# EAGLE design power_tester (EAGLE 6.1)
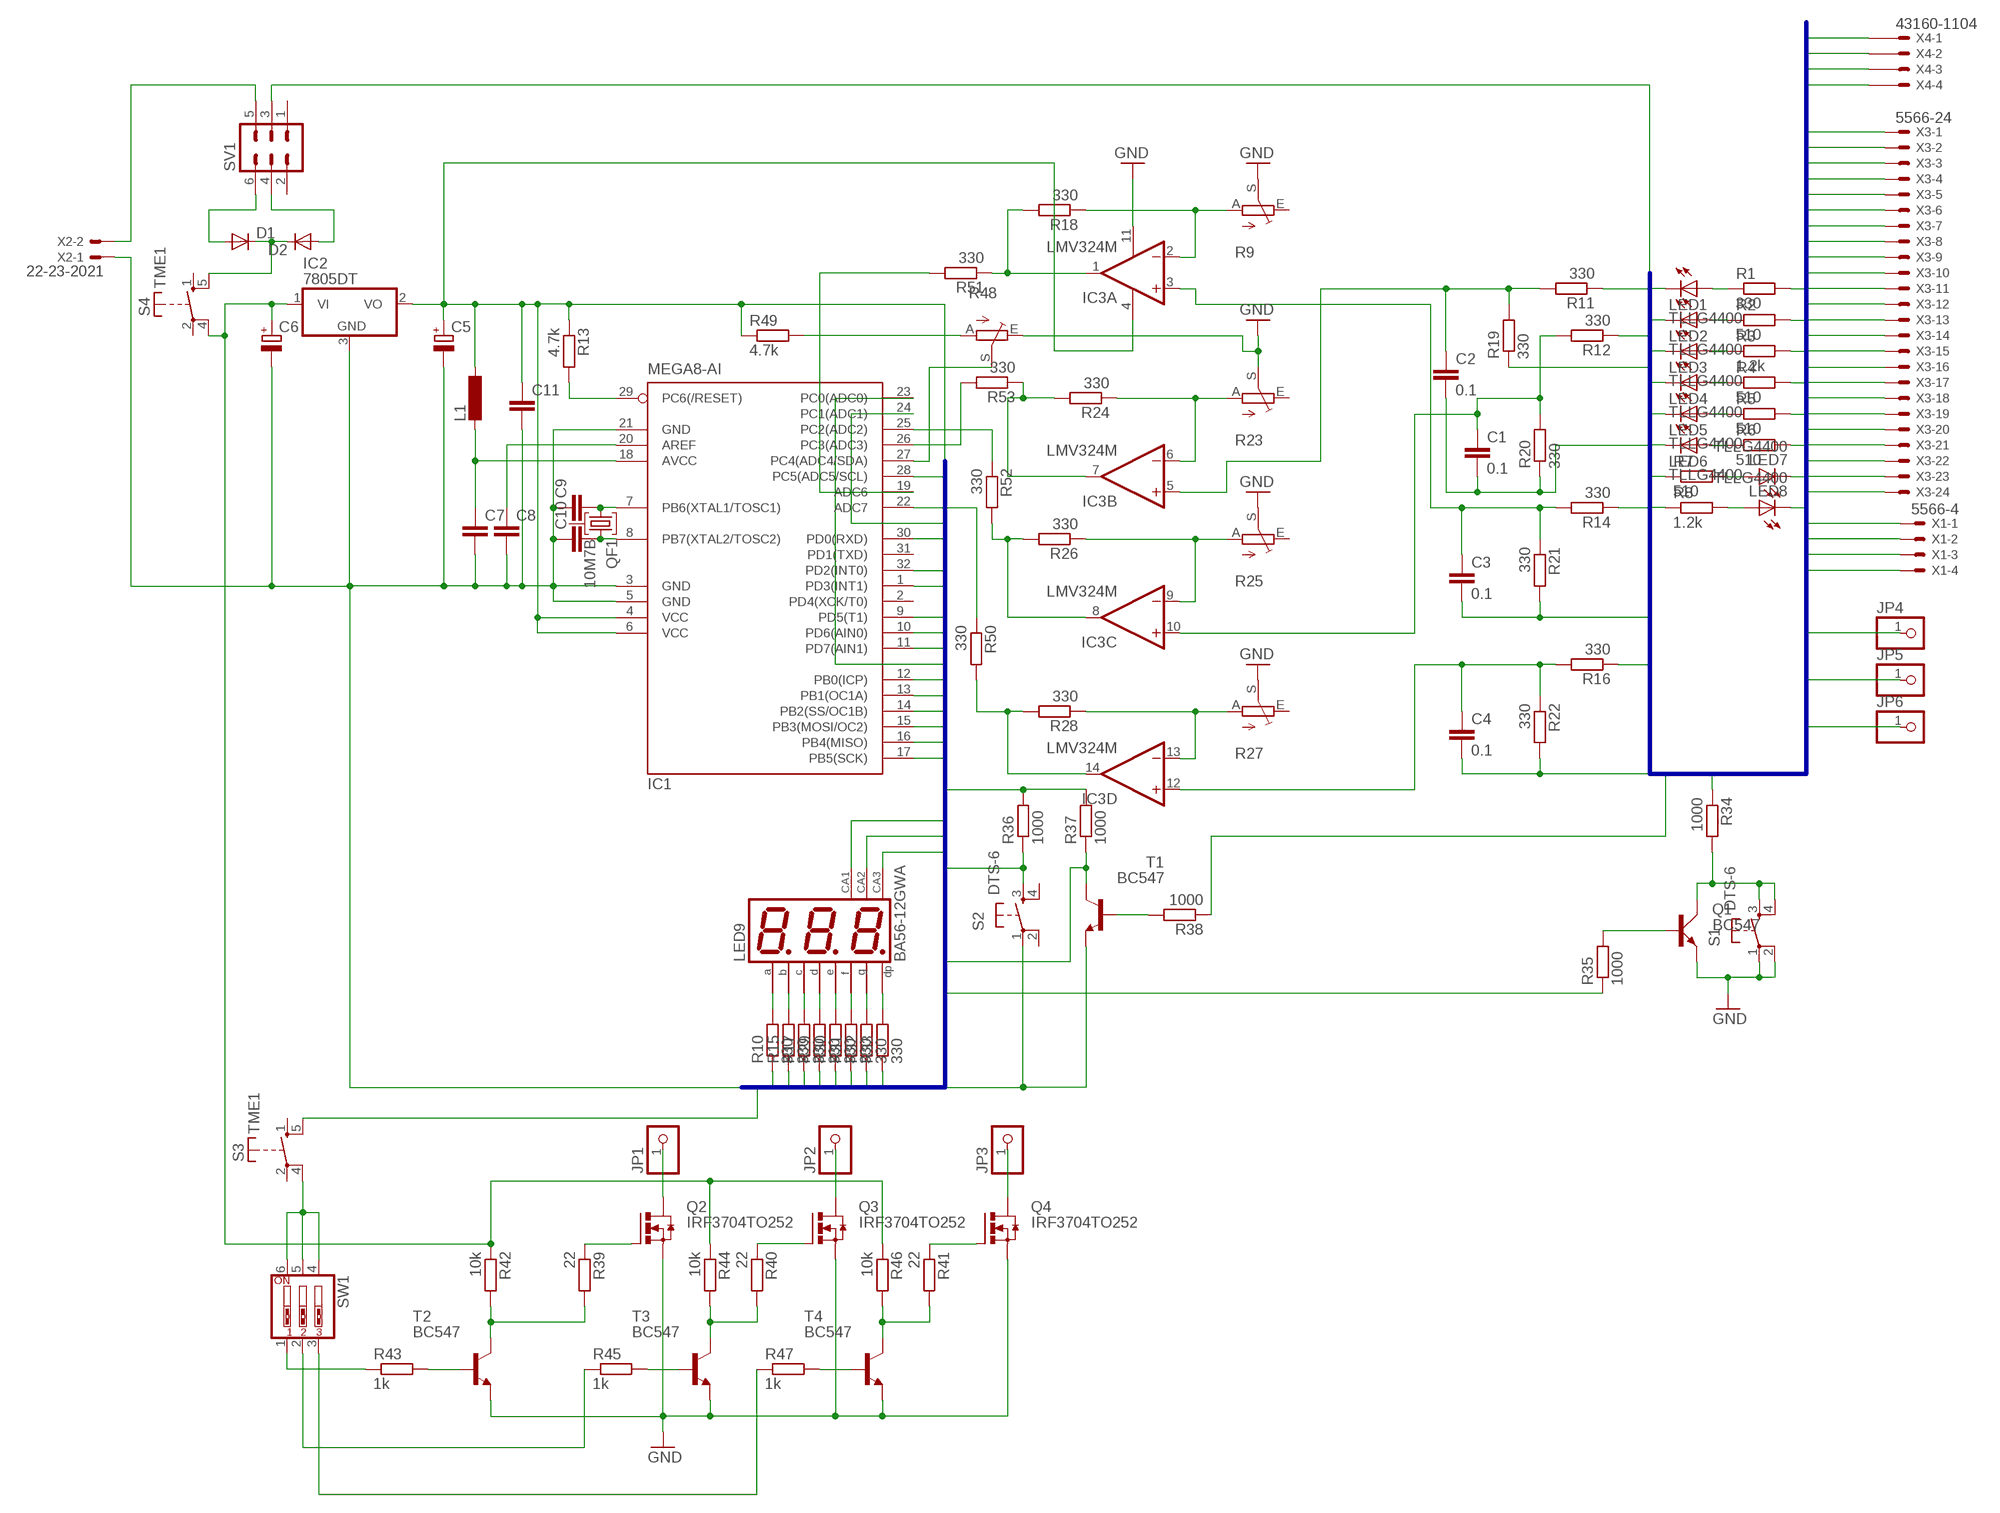
[diagram p0: schematic, sheet 1]

## Parts
C1  0.1  C-EUC1206  [C1206]
C2  0.1  C-EUC1206  [C1206]
C3  0.1  C-EUC1206  [C1206]
C4  0.1  C-EUC1206  [C1206]
C5  CPOL-EUE2.5-7  [E2,5-7]
C6  CPOL-EUE2.5-7  [E2,5-7]
C7  C-EUC1206  [C1206]
C8  C-EUC0805K  [C0805K]
C9  C-EUC1206  [C1206]
C10  C-EUC1206  [C1206]
C11  C-EUC1206  [C1206]
D1  DIODE-DO214BA  [DO214BA]
D2  DIODE-DO214BA  [DO214BA]
IC1  MEGA8-AI  [TQFP32-08]
IC2  7805DT  [TO252]
IC3  LMV324M  [SO14]
JP1  PINHD-1X1  [1X01]
JP2  PINHD-1X1  [1X01]
JP3  PINHD-1X1  [1X01]
JP4  PINHD-1X1  [1X01]
JP5  PINHD-1X1  [1X01]
JP6  PINHD-1X1  [1X01]
L1  DO3316P  [DO3316P]
LED1  TLLG4400  [LED3MM]
LED2  TLLG4400  [LED3MM]
LED3  TLLG4400  [LED3MM]
LED4  TLLG4400  [LED3MM]
LED5  TLLG4400  [LED3MM]
LED6  TLLG4400  [LED3MM]
LED7  TLLG4400  [LED3MM]
LED8  TLLG4400  [LED3MM]
LED9  BA56-12GWA  [BX56-12]
Q1  BC547  [SOT54A]
Q2  IRF3704TO252  [D-PAK_TO252AA]
Q3  IRF3704TO252  [D-PAK_TO252AA]
Q4  IRF3704TO252  [D-PAK_TO252AA]
QF1  10M7B  [HC49U]
R1  330  R-EU_R1206  [R1206]
R2  510  R-EU_R1206  [R1206]
R3  1.2k  R-EU_R1206  [R1206]
R4  510  R-EU_R1206  [R1206]
R5  510  R-EU_R1206  [R1206]
R6  510  R-EU_R1206  [R1206]
R7  510  R-EU_R1206  [R1206]
R8  1.2k  R-EU_R1206  [R1206]
R9  TRIM_EU-S64W  [S64W]
R10  330  R-EU_R1206W  [R1206W]
R11  330  R-EU_R1206  [R1206]
R12  330  R-EU_R1206  [R1206]
R13  4.7k  R-EU_R1206W  [R1206W]
R14  330  R-EU_R1206  [R1206]
R15  330  R-EU_R1206W  [R1206W]
R16  330  R-EU_R1206  [R1206]
R17  330  R-EU_R1206  [R1206]
R18  330  R-EU_R1206  [R1206]
R19  330  R-EU_R1206  [R1206]
R20  330  R-EU_R1206  [R1206]
R21  330  R-EU_R1206  [R1206]
R22  330  R-EU_R1206  [R1206]
R23  TRIM_EU-S64W  [S64W]
R24  330  R-EU_R1206  [R1206]
R25  TRIM_EU-S64W  [S64W]
R26  330  R-EU_R1206  [R1206]
R27  TRIM_EU-S64W  [S64W]
R28  330  R-EU_R1206  [R1206]
R29  330  R-EU_R1206  [R1206]
R30  330  R-EU_R1206  [R1206]
R31  330  R-EU_R1206W  [R1206W]
R32  330  R-EU_R1206W  [R1206W]
R33  330  R-EU_R1206W  [R1206W]
R34  1000  R-EU_R1206  [R1206]
R35  1000  R-EU_R1206W  [R1206W]
R36  1000  R-EU_R1206W  [R1206W]
R37  1000  R-EU_R1206W  [R1206W]
R38  1000  R-EU_R1206  [R1206]
R39  22  R-EU_R1206W  [R1206W]
R40  22  R-EU_R1206W  [R1206W]
R41  22  R-EU_R1206W  [R1206W]
R42  10k  R-EU_R1206W  [R1206W]
R43  1k  R-EU_R1206  [R1206]
R44  10k  R-EU_R1206W  [R1206W]
R45  1k  R-EU_R1206  [R1206]
R46  10k  R-EU_R1206W  [R1206W]
R47  1k  R-EU_R1206  [R1206]
R48  TRIM_EU-CA6V  [CA6V]
R49  4.7k  R-EU_R1206  [R1206]
R50  330  R-EU_R1206  [R1206]
R51  330  R-EU_R1206W  [R1206W]
R52  330  R-EU_R1206  [R1206]
R53  330  R-EU_R1206  [R1206]
S1  DTS-6  [DTS-6]
S2  DTS-6  [DTS-6]
S3  TME1  [TME1]
S4  TME1  [TME1]
SV1  MA03-2  [MA03-2]
SW1  SW_DIP-3  [EDG-03]
T1  BC547  [TO92]
T2  BC547  [TO92]
T3  BC547  [TO92]
T4  BC547  [TO92]
X1  5566-4  [5566-4]
X2  22-23-2021  [22-23-2021]
X3  5566-24  [5566-24]
X4  43160-1104  [43160-XX04]

## Nets
A: IC1.17(PB5(SCK)) R10.1
B: IC1.16(PB4(MISO)) R15.1
C: IC1.15(PB3(MOSI/OC2)) R17.1
CA1: IC1.23(PC0(ADC0)) LED9.12(CA)
CA2: IC1.24(PC1(ADC1)) LED9.9(CA)
CA3: IC1.28(PC5(ADC5/SCL)) LED9.8(CA)
D: IC1.14(PB2(SS/OC1B)) R29.1
DEGUR_5V: R6.2 R16.1 X3.9
DOWN_TO_ZERO: Q1.C R34.2 S1.3 S1.4
DP: IC1.9(PD5(T1)) R33.1
E: IC1.12(PB0(ICP)) R30.1
F: IC1.11(PD7(AIN1)) R31.1
G: IC1.10(PD6(AIN0)) R32.1
GND: C1.2 C2.2 C3.2 C4.2 C5.- C6.- C7.2 C8.2 C9.1 C10.1 C11.2 IC1.3(GND) IC1.5(GND) IC1.21(GND) IC2.3(GND) IC3.11(P:V-) LED1.K(C) LED2.K(C) LED3.K(C) LED4.K(C) LED5.K(C) LED6.K(C) Q1.E Q2.4(S) Q3.4(S) Q4.4(S) R7.1 R8.1 R9.S R19.1 R20.1 R21.2 R22.2 R23.S R25.S R27.S R48.E S1.1 S1.2 S2.1 T1.1(E) T2.1(E) T3.1(E) T4.1(E) X1.1 X1.2 X2.1 X3.3 X3.5 X3.7 X3.15 X3.17 X3.18 X3.19 X3.24 X4.2@1(-2:S) X4.3@1(-3:S)
LED_SWITCH: IC1.1(PD3(INT1)) R36.1 S2.3
N$1: LED1.A R1.1
N$2: LED3.A R3.1
N$3: LED2.A R2.1
N$4: LED4.A R4.1
N$5: LED5.A R5.1
N$6: LED6.A R6.1
N$7: LED7.A R7.2
N$8: LED8.A R8.2
N$9: IC1.29(PC6(/RESET)) R13.2
N$10: R39.2 R42.2 T2.3(C)
N$11: R40.2 R44.2 T3.3(C)
N$12: C3.1 IC3.3(A:+IN) R14.2 R21.1
N$13: IC3.2(A:-IN) R9.A R18.1
N$14: C4.1 IC3.12(D:+IN) R16.2 R22.1
N$15: C2.1 IC3.5(B:+IN) R11.2 R19.2
N$16: C1.1 IC3.10(C:+IN) R12.2 R20.2
N$17: C9.2 IC1.7(PB6(XTAL1/TOSC1)) QF1.1
N$18: C10.2 IC1.8(PB7(XTAL2/TOSC2)) QF1.3
N$19: C6.+ IC2.1(VI) R42.1 R44.1 R46.1 S4.4(P)
N$20: IC3.1(A:OUT) R18.2 R51.1
N$21: IC3.7(B:OUT) R24.2 R53.1
N$22: IC3.6(B:-IN) R23.A R24.1
N$23: D1.A SV1.6
N$24: IC3.8(C:OUT) R26.2 R52.2
N$25: IC3.9(C:-IN) R25.A R26.1
N$26: IC3.14(D:OUT) R28.2 R50.2
N$27: IC3.13(D:-IN) R27.A R28.1
N$28: LED9.11(A) R10.2
N$29: D2.A SV1.4
N$30: LED9.7(B) R15.2
N$31: SV1.5 X2.2
N$32: LED9.4(C) R17.2
N$33: C7.1 IC1.18(AVCC) L1.1
N$34: LED9.2(D) R29.2
N$35: LED9.1(E) R30.2
N$36: LED9.10(F) R31.2
N$37: LED9.5(G) R32.2
N$38: LED9.3(DP) R33.2
N$39: Q1.B R35.2
N$40: R38.2 T1.2(B)
N$41: R47.2 T4.2(B)
N$42: Q3.1(G) R40.1
N$43: Q4.1(G) R41.1
N$44: Q2.1(G) R39.1
N$45: R41.2 R46.2 T4.3(C)
N$46: R43.2 T2.2(B)
N$47: JP1.1 Q2.3(D)
N$48: JP2.1 Q3.3(D)
N$49: JP3.1 Q4.3(D)
N$50: R45.2 T3.2(B)
N$51: R48.A R49.2
N$52: R43.1 SW1.1
N$53: R45.1 SW1.2
N$54: R47.1 SW1.3
N$55: S3.4(P) SW1.4 SW1.5 SW1.6
N$56: IC1.27(PC4(ADC4/SDA)) R48.S
N$57: D1.C D2.C S4.5(S)
N$58: IC1.22(ADC7) R50.1
N$59: IC1.19(ADC6) R51.2
N$60: IC1.25(PC2(ADC2)) R52.1
N$61: IC1.26(PC3(ADC3)) R53.2
N$62: C8.1 IC1.20(AREF)
PS_ON: R5.2 R34.1 X3.16
PS_ON_CONTROL: IC1.30(PD0(RXD)) R35.1
PWN_LOAD: IC1.13(PB1(OC1A)) S3.5(S)
PWR_OK: R4.2 R38.1 X3.8
PWR_OK_CONTROL: IC1.32(PD2(INT0)) R37.1 T1.3(C)
VCC5V: C5.+ C11.1 IC1.4(VCC) IC1.6(VCC) IC2.2(VO) IC3.4(P:V+) L1.2 R13.1 R36.2 R37.2 R49.1
VDC3: JP4.1 R1.2 R14.1 X3.1 X3.2 X3.12 X3.13
VDC5: JP5.1 R2.2 R11.1 X3.4 X3.6 X3.21 X3.22 X3.23 X4.4@1(-4:S)
VDC12: JP6.1 R3.2 R12.1 SV1.3 X1.3 X1.4 X3.10 X3.11 X4.1@1(-1:S)
VDC-5: LED7.K(C) X3.20
VDC-12: LED8.K(C) X3.14
Unconnected: IC1.2(PD4(XCK/T0)) IC1.31(PD1(TXD)) QF1.2 R9.E R23.E R25.E R27.E S2.2 S2.4 S3.1(S) S3.2(P) S4.1(S) S4.2(P) SV1.1 SV1.2 X4.1@2(-1:S) X4.2@2(-2:S) X4.3@2(-3:S) X4.4@2(-4:S)

## Buses
GND,VDC3,VDC5,VDC12,PWR_OK,VDC-5,VDC-12,PS_ON,DEGUR_5V
A,B,C,D,E,F,G,DP,CA[1..3],VCC5V,GND,PS_ON_CONTROL,LED_SWITCH,PWR_OK_CONTROL,PWN_LOAD

## Library data of the parts
C1-C4 C7 C8 = rcl:C-EU: CAPACITOR, European symbol
C5 C6 = rcl:CPOL-EU: POLARIZED CAPACITOR, European symbol
C9-C11 = resistor:C-EU: CAPACITOR, European symbol
D1 D2 = diode:DIODE-: DIODE
IC1 = atmel:MEGA8: MICROCONTROLLER 8 Kbytes FLASH, 1 kbytes SRAM, 512 bytes EEPROM, USART, 6-channel 10 bit ADC, 2-channel 8 bit ADC Pin compatible with Atmega48, ATMega88, ATMega168 Source: avr.lbr; MPN: ATMEGA8-16AU; OC_FARNELL: 9171371; OC_NEWARK: 73M8863
IC2 = linear:78*: Positive VOLTAGE REGULATOR Source: http://cache.national.com/ds/LM/LM78L05.pdf http://www.fairchildsemi.com/ds/LM/LM7805.pdf
IC3 = linear:LMV324?*: Quad General Purpose, Low Voltage, Rail-to-Rail Output Operational Amplifiers Source: http://www.national.com/mpf/LM/LMV321.html http://www.national.com/dt/lmv_qual.pdf
JP1-JP6 = pinhead:PINHD-1X1: PIN HEADER
L1 = inductor-coilcraft:DO3316P: COILCRAFT; OC_FARNELL: unknown; OC_NEWARK: unknown
LED1-LED8 = led:TLLG4400: Low Current (2mA) LED 3 mm Tinted Diffused Package color GREEN Source: Data sheet <http://www.farnell.com/datasheets/391098.pdf>; MF: VISHAY SEMICONDUCTOR; OC_FARNELL: 1612435
LED9 = display-kingbright:B?56-12*WA: 14.22mm (0.56INCH) THREE DIGIT NUMERIC DISPLAY Source: http://www.kingbright.com .. BA56-11EWA(Ver1189474895.pdf; OC_FARNELL: unknown; OC_NEWARK: unknown
Q1 = transistor-small-signal:BC547: NPN TRANSISTOR
Q2-Q4 = transistor-power:IRF3704: SMPS MOSFET HEXFET® Power MOSFET Source: http://www.irf.com/product-info/datasheets/data/irf3704.pdf
QF1 = crystal:10M*B: Monolithic Crystal Filters Source: www.vanlong.com; OC_FARNELL: unknown; OC_NEWARK: unknown
R1-R8 R10-R22 R24 R26 R28-R47 R49-R53 = resistor:R-EU_: RESISTOR, European symbol
R9 R23 R25 R27 R48 = pot:TRIM_EU-: POTENTIOMETER
S1 S2 = switch-tact:DTS-6
S3 S4 = switch-misc:TME1: SWITCH
SV1 = con-lstb:MA03-2: PIN HEADER; OC_FARNELL: unknown; OC_NEWARK: unknown
SW1 = special:SW_DIP-3: DIP SWITCH
T1-T4 = transistor:BC547: NPN TRANSISTOR
X1 = con-molex:5566-4: Mini FIT connector 4 pol Source: http://www.molex.com; OC_FARNELL: unknown; OC_NEWARK: unknown
X2 = con-molex:22-23-2021: .100" (2.54mm) Center Header - 2 Pin; MF: MOLEX; MPN: 22-23-2021; OC_FARNELL: 1462926; OC_NEWARK: 25C3832
X3 = con-molex:5566-24: Mini FIT connector 24 pol Source: http://www.molex.com; OC_FARNELL: unknown; OC_NEWARK: unknown
X4 = con-molex:43160-*04: SDA-43160 Connector Source: http://www.molex.com/pdm_docs/sd/431601306_sd.pdf; MF: WALDOM/MOLEX; MPN: 43160-1104; OC_FARNELL: unknown; OC_NEWARK: 54H0257

## Board
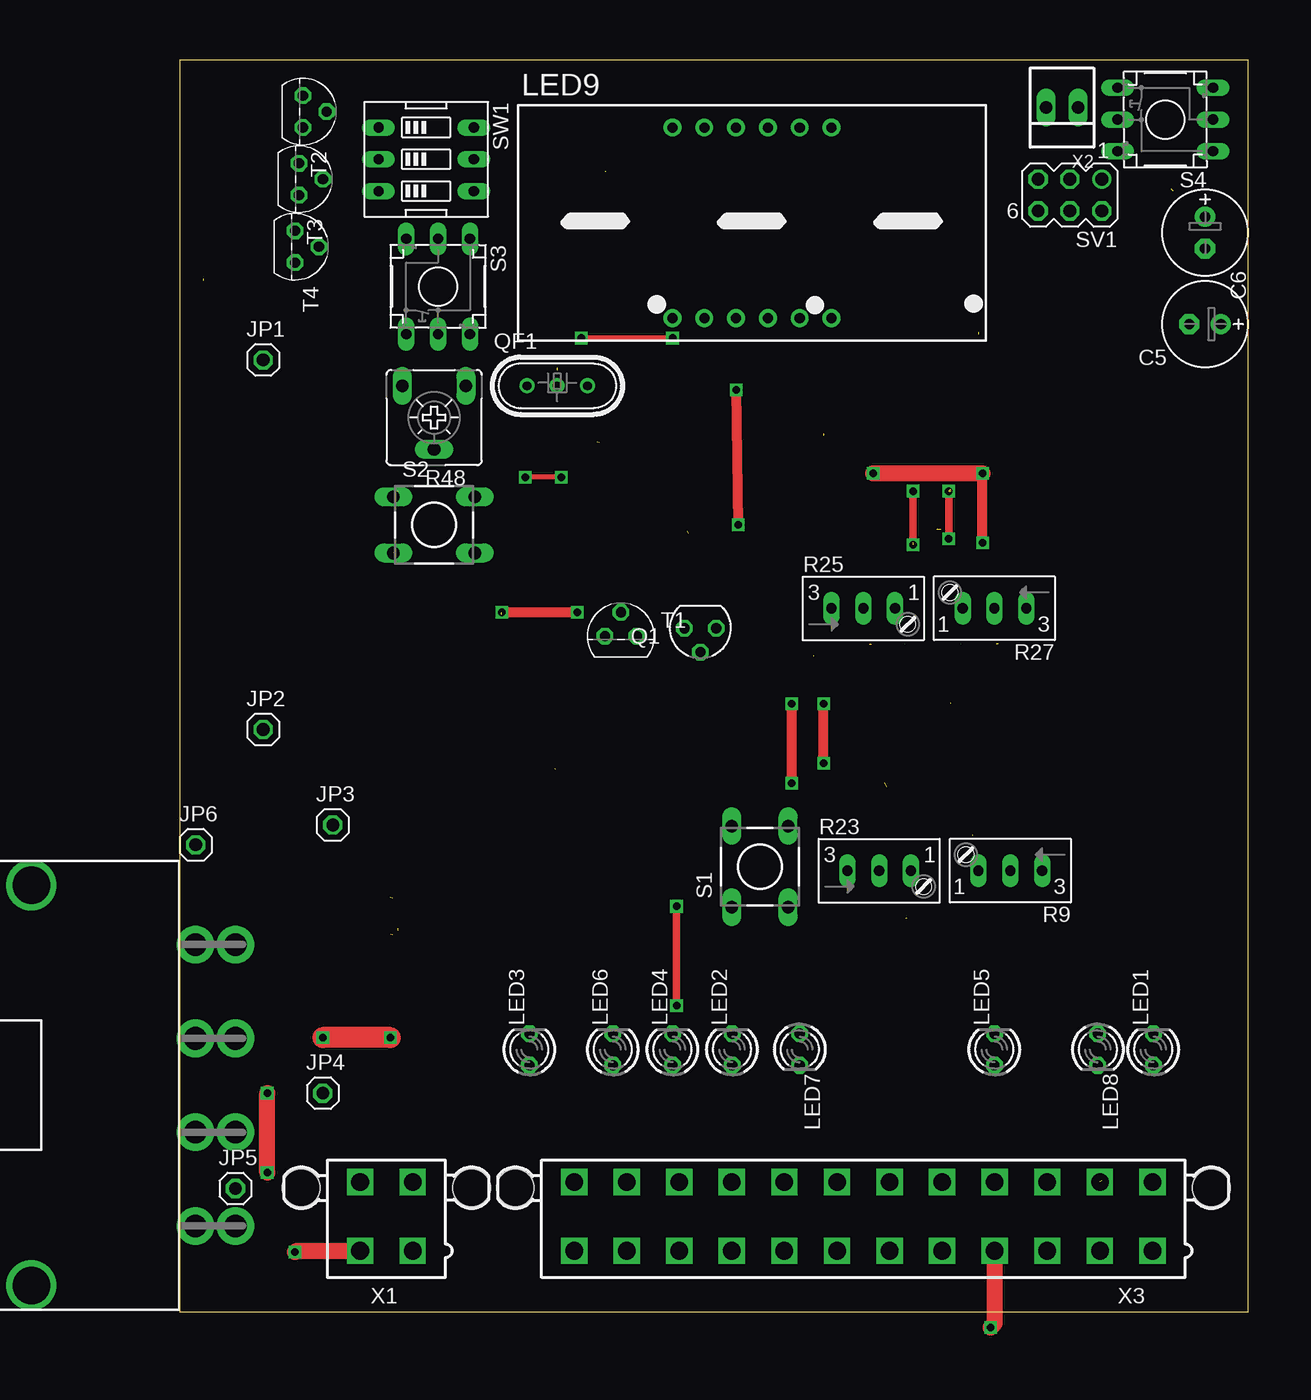
[diagram p1: board, top side]
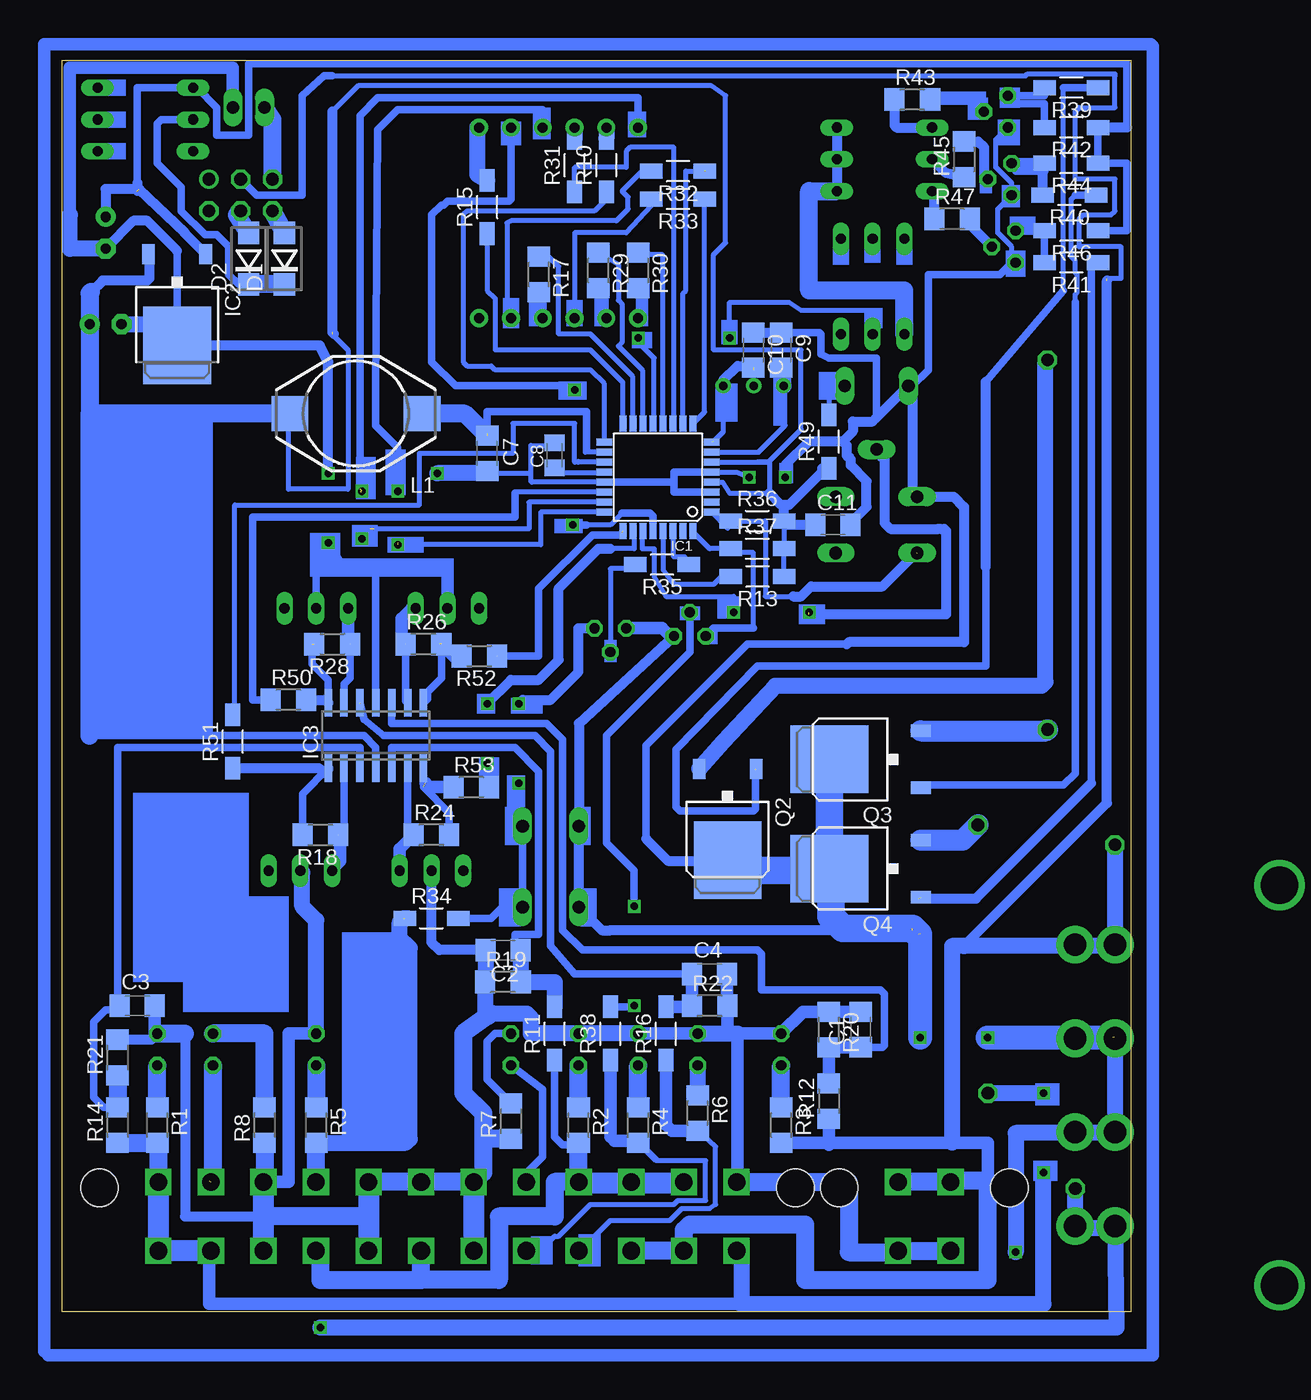
[diagram p2: board, bottom side, seen from below]

Size 85.39 x 100 mm. Coordinates in mm from the lower left corner, seen from the top.
Outline: 0,0 85.39,0 85.39,100 0,100 0,0
Copper layers (1*16): Top 0.035mm / dielectric 1.5mm / Bottom 0.035mm
Design rules: minimum track width 10mil, minimum drill 24mil, track to track 8mil, track to pad 8mil, pad to pad 8mil, via to via 8mil, smd to smd 8mil, copper to edge 40mil, drill to drill 8mil, minimum pad ring 10mil, minimum via ring 8mil, stop-mask expansion 4mil, vias tented up to drill 0mil, thermal gap 10mil

### Footprints (pad centres in the part's own frame; a part is rotated, then mirrored left to right if it is on the bottom)
C1206 = smd 1.6 x 1.8: 1 -1.4,0; 2 1.4,0
E2,5-7 = drill 0.813 pad 1.6: + -1.27,0 | drill 0.813 pad 1.6 octagon: - 1.27,0
C0805K = smd 1.3 x 1.6: 1 -1,0; 2 1,0
DO214BA = smd 1.8 x 1.7: A 2.05,0; C -2.05,0
TQFP32-08 = smd 1.27 x 0.559: 1 -4.293,2.8; 2 -4.293,2; 3 -4.293,1.2; 4 -4.293,0.4; 5 -4.293,-0.4; 6 -4.293,-1.2; 7 -4.293,-2; 8 -4.293,-2.8; 17 4.293,-2.8; 18 4.293,-2; 19 4.293,-1.2; 20 4.293,-0.4; 21 4.293,0.4; 22 4.293,1.2; 23 4.293,2; 24 4.293,2.8 | smd 0.559 x 1.27: 9 -2.8,-4.293; 10 -2,-4.293; 11 -1.2,-4.293; 12 -0.4,-4.293; 13 0.4,-4.293; 14 1.2,-4.293; 15 2,-4.293; 16 2.8,-4.293; 25 2.8,4.293; 26 2,4.293; 27 1.2,4.293; 28 0.4,4.293; 29 -0.4,4.293; 30 -1.2,4.293; 31 -2,4.293; 32 -2.8,4.293
TO252 = smd 1 x 1.6: 1 -2.28,-4.8; 2 2.28,-4.8 | smd 5.4 x 6.2: 3 0,2.5
SO14 = smd 0.6 x 2.2: 1 -3.81,-2.6; 2 -2.54,-2.6; 3 -1.27,-2.6; 4 0,-2.6; 5 1.27,-2.6; 6 2.54,-2.6; 7 3.81,-2.6; 8 3.81,2.6; 9 2.54,2.6; 10 1.27,2.6; 11 0,2.6; 12 -1.27,2.6; 13 -2.54,2.6; 14 -3.81,2.6
1X01 = drill 1.016 octagon: 1 0,0
DO3316P = smd 2.92 x 2.79: 1 -5.28,0; 2 5.28,0
LED3MM = drill 0.813 octagon: A -1.27,0; K 1.27,0
BX56-12 = drill 0.8 pad 1.422: 1 -6.35,-7.62; 2 -3.81,-7.62; 3 -1.27,-7.62; 4 1.27,-7.62; 5 3.81,-7.62; 6 6.35,-7.62; 7 6.35,7.62; 8 3.81,7.62; 9 1.27,7.62; 10 -1.27,7.62; 11 -3.81,7.62; 12 -6.35,7.62
SOT54A = drill 0.813 octagon: B 0,1.905; C -1.27,0; E 1.27,0
D-PAK_TO252AA = smd 1 x 1.6: 1 -2.28,-4.8; 3 2.28,-4.8 | smd 5.4 x 6.2: 4 0,2.5
HC49U = drill 0.7 pad 1.2: 1 -2.413,0; 2 -0.027,0; 3 2.413,0
R1206 = smd 1.6 x 1.803: 1 -1.422,0; 2 1.422,0
S64W = drill 0.813 long: A 2.54,1.27; E -2.54,1.27; S 0,1.27
R1206W = smd 1.8 x 1.2: 1 -2.134,0; 2 2.134,0
CA6V = drill 1.016 long: A -2.54,-2.54; E 2.54,-2.54; S 0,2.54
DTS-6 = drill 1 long: 1 -3.25,2.25; 2 3.25,2.25; 3 -3.25,-2.25; 4 3.25,-2.25
TME1 = drill 0.813 long: 1 -2.54,-3.81; 2 0,-3.81; 3 2.54,-3.81; 4 2.54,3.81; 5 0,3.81; 6 -2.54,3.81
MA03-2 = drill 1.016: 1 -2.54,-1.27 | drill 1.016 octagon: 2 -2.54,1.27; 3 0,-1.27; 4 0,1.27; 5 2.54,-1.27; 6 2.54,1.27
EDG-03 = drill 0.813 long: 1 -2.54,-3.81; 2 0,-3.81; 3 2.54,-3.81; 4 2.54,3.81; 5 0,3.81; 6 -2.54,3.81
TO92 = drill 0.813 octagon: 1 1.27,0; 2 0,1.905; 3 -1.27,0
5566-4 = drill 1.4 square: 1 2.1,-2.75; 2 -2.1,-2.75; 3 2.1,2.75; 4 -2.1,2.75 | hole 3: 6.8,2.29; -6.8,2.29
22-23-2021 = drill 1 long: 1 -1.27,0; 2 1.27,0
5566-24 = drill 1.4 square: 1 23.1,-2.75; 2 18.9,-2.75; 3 14.7,-2.75; 4 10.5,-2.75; 5 6.3,-2.75; 6 2.1,-2.75; 7 -2.1,-2.75; 8 -6.3,-2.75; 9 -10.5,-2.75; 10 -14.7,-2.75; 11 -18.9,-2.75; 12 -23.1,-2.75; 13 23.1,2.75; 14 18.9,2.75; 15 14.7,2.75; 16 10.5,2.75; 17 6.3,2.75; 18 2.1,2.75; 19 -2.1,2.75; 20 -6.3,2.75; 21 -10.5,2.75; 22 -14.7,2.75; 23 -18.9,2.75; 24 -23.1,2.75 | hole 3: 27.8,2.29; -27.8,2.29
43160-XX04 = drill 1.8 pad 3: 1@1 -11.235,0; 1@2 -11.235,3.18; 2@1 -3.745,0; 2@2 -3.745,3.18; 3@1 3.745,0; 3@2 3.745,3.18; 4@1 11.235,0; 4@2 11.235,3.18 | drill 3 pad 3.4: M1 -15.985,-13.13; M2 15.985,-13.13

### Placement (x,y rotation side)
C1  21.59,22.54 90 bottom
C2  50.16,28.89 180 bottom
C3  79.38,24.45 0 bottom
C4  33.66,26.99 0 bottom
C5  81.92,78.9 180 top
C6  81.92,86.2 270 top
C7  51.43,68.58 270 bottom
C8  46.04,68.42 90 bottom
C9  27.94,76.83 270 bottom
C10  30.16,76.83 270 bottom
C11  23.81,62.87 0 bottom
D1  67.63,84.14 90 bottom
D2  70.48,84.14 90 bottom
IC1  37.78,66.67 180 bottom
IC2  76.2,79.69 180 bottom
IC3  60.32,46.04 0 bottom
JP1  6.67,76.04 0 top
JP2  6.67,46.51 0 top
JP3  12.22,38.89 0 top
JP4  11.43,17.46 0 top
JP5  4.45,9.84 0 top
JP6  1.27,37.31 0 top
L1  61.91,71.75 180 bottom
LED1  77.79,20.95 90 top
LED2  44.13,20.95 90 top
LED3  27.94,20.95 90 top
LED4  39.37,20.95 90 top
LED5  65.09,20.95 90 top
LED6  34.61,20.95 90 top
LED7  49.53,20.95 270 top
LED8  73.34,20.95 270 top
LED9  45.72,87 0 top
Q1  41.59,54.61 180 top
Q2  32.23,38.58 180 bottom
Q3  21.59,44.13 90 bottom
Q4  21.59,35.4 90 bottom
QF1  30.16,73.98 0 top
R1  77.79,14.92 270 bottom
R2  44.13,14.92 270 bottom
R3  27.94,14.92 270 bottom
R4  39.37,14.92 270 bottom
R5  65.09,14.92 270 bottom
R6  34.61,15.88 270 bottom
R7  49.53,15.24 90 bottom
R8  69.22,14.92 90 bottom
R9  66.36,36.51 180 top
R10  41.91,91.6 90 bottom
R11  330  [R1206W]  46.04,22.23 90 bottom
R12  24.13,16.83 90 bottom
R13  29.85,58.74 180 bottom
R14  80.96,14.92 90 bottom
R15  51.43,88.27 90 bottom
R16  330  [R1206W]  37.15,22.23 90 bottom
R17  47.31,82.87 270 bottom
R18  64.77,38.1 180 bottom
R19  50.16,26.35 0 bottom
R20  24.13,22.54 270 bottom
R21  80.96,20.32 90 bottom
R22  33.66,24.45 0 bottom
R23  55.88,33.97 0 top
R24  55.88,38.1 0 bottom
R25  54.61,54.93 0 top
R26  56.52,53.34 0 bottom
R27  65.09,57.47 180 top
R28  63.82,53.34 180 bottom
R29  42.54,83.19 270 bottom
R30  39.37,83.19 270 bottom
R31  44.45,91.6 90 bottom
R32  36.2,91.12 180 bottom
R33  36.2,88.9 180 bottom
R34  1000  [R1206W]  55.88,31.43 0 bottom
R35  37.46,59.69 180 bottom
R36  29.85,63.18 0 bottom
R37  29.85,60.96 0 bottom
R38  1000  [R1206W]  41.59,22.23 90 bottom
R39  4.76,97.79 180 bottom
R40  4.92,89.22 180 bottom
R41  4.76,83.82 180 bottom
R42  4.76,94.61 180 bottom
R43  17.46,96.84 0 bottom
R44  4.76,91.76 180 bottom
R45  13.34,92.08 90 bottom
R46  4.76,86.36 180 bottom
R47  14.29,87.31 0 bottom
R48  20.32,71.44 180 top
R49  4.7k  [R1206W]  24.13,69.53 90 bottom
R50  67.31,48.9 0 bottom
R51  71.76,45.56 90 bottom
R52  52.07,52.39 180 bottom
R53  52.7,41.91 0 bottom
S1  46.35,35.56 90 top
S2  20.32,62.87 0 top
S3  20.64,81.92 180 top
S4  78.74,95.25 90 top
SV1  71.12,89.22 180 top
SW1  19.68,92.08 270 top
T1  35.24,53.98 0 top
T2  9.84,95.89 270 top
T3  9.53,90.49 270 top
T4  9.21,85.09 270 top
X1  16.51,7.62 0 top
X2  70.48,96.2 180 top
X3  54.61,7.62 0 top
X4  1.27,18.1 270 top

### Tracks (layer width: path | path; a pad name or v marks a point on that pad's centre or on a via)
A
  Bottom 0.406: IC1.17 42.07,74.14 43.18,75.25 50.8,75.25 51.12,75.56 53.02,75.56 53.34,75.88 53.34,87.63 53.02,87.95 42.86,87.95 41.91,88.9 R10.1
B
  Bottom 0.406: IC1.16 40.58,74.24 43.18,76.83 50.8,76.83 50.8,80.96 51.43,81.6 R15.1
C
  Bottom 0.406: IC1.15 39.78,74.71 43.18,78.11 45.72,78.11 45.72,83.5 46.99,84.77 47.31,84.45 R17.1
CA1  (via drill 0.6)  (4 unrouted)
  Top 0.61: v61.44,61.75 v61.44,65.56
  Bottom 0.406: 61.59,65.72 61.51,65.47 | IC1.23 48.1,64.67 48.1,62.55 60.48,62.55 60.48,62.39 61.12,61.75 v61.44,61.75
  Bottom 0.61: LED9.12 39.37,97 60.17,97 61.59,95.57 61.59,65.72 v61.44,65.56 61.59,65.56
CA2  (via drill 0.6)  (1 unrouted)
  Top 0.61: v58.58,65.56 v58.58,61.28
  Bottom 0.406: IC1.24 47.15,63.88 47.15,61.28 v58.58,61.28
  Bottom 0.61: LED9.9 46.99,96.04 58.58,96.04 60.17,94.46 60.32,73.34 60.32,70.8 58.58,69.06 v58.58,65.56 | v58.58,61.28 58.58,61.44
CA3  (via drill 0.6)
  Top 0.813: v44.45,73.66 v44.61,62.87
  Bottom 0.406: 40.64,63.82 41.59,62.87 43.5,62.87
  Bottom 0.61: v44.45,73.66 44.45,73.98 53.97,73.98 55.88,75.88 55.88,87.63 55.09,88.42 54.93,88.42 54.61,88.74 49.69,88.74 49.53,88.9 LED9.8 | IC1.28 38.18,63.58 38.42,63.82 40.64,63.82 | 43.5,62.87 v44.61,62.87
D
  Bottom 0.406: IC1.14 38.98,75.18 40.96,77.15 40.64,77.47 40.64,80.49 40.96,80.8 40.96,83.65 R29.1
DEGUR_5V
  Bottom 0.406: X3.9 44.02,4.87 41.59,7.3 36.83,7.3 35.88,8.26 33.66,8.26 33.18,8.57 33.18,13.18 R6.2
  Bottom 1.016: R16.1 37.15,14.92 36.68,14.45 R6.2
DOWN_TO_ZERO  (via drill 0.6)
  Top 0.813: v48.89,42.23 v48.89,48.58
  Bottom 0.61: R34.2 51.12,31.43 50.16,32.38 50.09,32.31 S1.3 S1.4
  Bottom 0.813: S1.4 48.89,39.1 v48.89,42.23 | v48.89,48.58 48.58,48.9 46.35,48.9 44.13,51.12 44.13,54.61 Q1.C
DP
  Bottom 0.406: IC1.9 34.06,71.89 R33.1
E
  Bottom 0.406: IC1.12 37.38,84.37 37.46,84.45 39.22,84.45 R30.1
F
  Bottom 0.406: IC1.11 36.51,71.04 36.51,93.03 40,93.03 40.32,92.71 40.32,91.44 44.45,91.44 R31.1
G  (1 unrouted)
  Bottom 0.406: IC1.10 35.78,81.38 35.56,81.6 35.56,91.12 33.97,91.12
GND  (via drill 0.6)  (4 unrouted)
  Top 0.406: v30.48,66.67 v27.62,66.67
  Top 0.813: v64.14,61.44 v64.14,66.99
  Top 1.27: v9.21,4.76 9.31,4.87 X1.2 | v55.4,66.99 v64.14,66.99
  Top 1.676: v16.83,21.91 v11.43,21.91
  Bottom 0.406: X3.15 69.53,10.37 69.53,8.26 | 69.53,7.62 69.53,8.26 | 69.53,8.26 69.85,8.26 69.85,7.62 | 47.94,66.99 47.94,66.36 47.86,66.28 IC1.21 | 47.94,66.99 47.94,69.22 46.09,69.22 C8.2 | C7.2 51.25,66.99 47.94,66.99 | IC1.5 31.52,67.08 v30.48,66.67 | v27.62,66.67 27.3,67.94 26.35,68.9 | 20.64,71.12 20.4,71.36 20.32,71.44 | S2.1 17.46,65.51 | 9.53,83.82 9.53,85.09 10.64,86.2 10.64,88.11 T3.1 9.53,90.17 10.79,91.44 10.79,93.66 T2.1
  Bottom 0.61: IC3.11 60.32,59.37 65.09,59.37 R27.S | IC2.3 76.2,79.06 76.2,84.77 | T4.1 9.53,83.82 10.48,82.87 16.19,82.87 16.19,75.25 17.46,73.98 R48.E | IC1.21 36.51,66.28 | IC1.5 36.51,67.08 36.51,66.28 | IC1.3 36.51,65.47 36.51,66.28 | C9.1 24.89,78.23 24.77,78.11 24.77,76.52 24.13,76.2 20.32,76.2 20.32,71.44 | 22.54,53.34 22.7,53.34 30.64,53.34 38.73,45.24 38.73,37.78 37.03,36.08 Q2.4
  Bottom 0.813: R21.2 78.27,21.74 LED1.K | T1.1 44.1,47.02 S1.2 S1.1 42.27,30.48 41.59,30.48 41.57,30.5 17.12,30.5 | v64.14,66.99 64.14,75.88 64.81,77.19 IC2.3 | 60.32,59.37 60.64,59.69 63.18,59.69 v64.14,61.44 | C10.1 C9.1 | 38.73,37.78 36.99,36.04 31.27,36.04 31.12,35.88 24.57,35.88 Q4.4 | 76.2,84.77 78.58,87.15 79.69,87.15 C6.- | C2.2 55.24,28.89 55.88,29.53 R23.S | 75.56,22.23 75.56,7.62 69.85,7.62 | 23.02,69.53 22.23,70.33 22.23,71.12 20.64,71.12 | 23.02,69.53 25.72,69.53 27.62,67.63 v27.62,66.67 | R48.E 20.4,71.36 | 17.46,73.98 17.46,65.56 16.99,65.09 | C11.2 22.41,62.99 21.11,64.29 21.11,66.36 22.38,67.63 22.38,68.1 22.7,68.42 22.7,69.22 23.02,69.53 | S2.1 14.16,65.11 13.34,64.29 13.34,53.5 22.54,53.5 22.7,53.34
  Bottom 1.016: LED5.K 67.31,22.23 67.31,10.37 X3.15 | X3.24 31.43,10.37 31.43,22.23 LED3.K 26.2,23.96 R20.1 24.11,23.94 C1.2 | LED4.K LED6.K | 32.07,22.23 32.23,22.39 R22.2 32.26,24.47 C4.2 | C3.2 77.98,22.41 LED1.K | X2.1 71.76,99.38 84.77,99.38 84.77,87.63 | R25.S 54.61,59.53 60.17,59.53 60.32,59.37 | T1.1 36.83,53.98 37.46,54.61 Q1.E
  Bottom 1.27: LED6.K 32.07,22.23 31.43,22.23 | LED4.K LED2.K 47.94,22.23 47.94,23.5 48.26,23.81 51.12,23.81 | C2.2 51.56,26.38 R19.1 51.59,23.82 51.39,23.62 | X4.3@1 X4.2@1 1.33,21.91 1.27,21.91 X4.3@1 | X4.3@1 1.27,13.97 1.59,14.29 9.21,14.29 v9.21,4.76 | 51.25,66.99 v55.4,66.99 | LED5.K 65.09,31.27 66.2,32.38 66.2,35.08 R9.S | C5.- 76.36,78.9 76.2,79.06 76.2,77.47 76.36,77.31 | C6.- 84.77,84.93 84.77,87.63
  Bottom 1.422: X3.17 X3.18 X3.19 51.75,11.13 51.75,13.65 | X3.5 60.96,4.87 60.96,7.62 69.31,7.62 | X3.24 22.54,10.37 22.54,4.76 18.61,4.76 X1.1 X1.2 | LED1.K 75.56,22.23 | R8.1 69.22,10.37 X3.15 | 51.12,23.81 51.39,23.62 53.34,22.23 53.34,17.46 51.75,15.88 51.75,13.65 | R7.1 51.59,13.82 51.75,13.65 | Q2.4 31.55,35.4
  Bottom 1.676: X3.15 69.31,7.62 X3.3 | X3.19 X3.7 | X3.17 X3.5 | 17.12,30.5 16.83,30.2
  Bottom 1.93: v16.83,21.91 16.83,29.84 17.46,30.48 | v11.43,21.91 1.43,21.91
  Bottom 2.184: Q3.4 Q4.4 | Q4.4 24.09,35.36 23.97,35.24 23.97,31.59 23.02,30.64 17.46,30.64 16.99,30.16 | 31.59,35.4 31.43,35.24 24.25,35.24 Q4.4
LED_SWITCH  (1 unrouted)
  Bottom 0.406: IC1.1 32.22,62.6 R36.1 29.21,63.18 29.21,57.15 26.99,57.15
  Bottom 0.813: 26.99,57.15 26.35,57.15 25.56,57.94 19.84,57.94 17.14,60.64
N$1
  Bottom 1.422: R1.1 LED1.A
N$2
  Bottom 1.422: R3.1 LED3.A
N$3
  Bottom 1.422: R2.1 LED2.A
N$4
  Bottom 1.422: R4.1 LED4.A
N$5
  Bottom 1.422: LED5.A R5.1
N$6
  Bottom 1.27: R6.1 LED6.A
N$7
  Bottom 0.61: LED7.A 50.8,22.23 51.43,21.59 51.43,18.57 R7.2
N$8
  Bottom 1.422: R8.2 69.22,22.23 LED8.A
N$9
  Bottom 0.406: 36.51,58.1 36.73,58.41 | 36.73,58.41 37.38,59.29 IC1.29 | R13.2 32.7,58.74 33.34,58.1 36.43,58.1 36.73,58.41
N$10
  Bottom 0.61: R39.2 6.9,97.16 T2.3 9.21,97.16 9.21,96.52 6.9,96.52 R42.2
N$11
  Bottom 0.61: 6.9,91.12 6.99,91.12 9.21,91.12 9.21,91.76 T3.3
  Bottom 0.813: R44.2 T3.3 | R40.2 7.05,91.05 6.99,91.12
N$12
  Bottom 0.61: R14.2 82.07,16.34 82.87,17.14 82.87,23.18 81.92,24.13 81.09,24.13 C3.1 80.96,24.64 80.96,45.09 61.59,45.09 IC3.3
  Bottom 1.422: R21.1 R14.2
N$13  (1 unrouted)
  Bottom 0.61: IC3.2 62.86,38.58 R18.1
  Bottom 1.016: R9.A 63.82,35.4 63.18,36.04 63.18,37.94 R18.1
N$14  (1 unrouted)
  Bottom 0.61: C4.1 44.45,26.99 46.35,29.21 46.35,44.77 47.62,46.04 59.69,46.04 61.28,47.31 61.59,48.58
  Bottom 1.016: R16.2 35.17,24.36 R22.1 35.08,26.96 C4.1
N$15
  Bottom 0.61: IC3.5 59.05,45.09 49.21,45.09 47.31,43.18 47.31,30.16 49.21,30.16 49.21,29.02 C2.1
  Bottom 1.27: C2.1 48.77,26.38 R19.2 46.04,26.35 R11.2
N$16
  Bottom 0.61: R20.2 19.84,21.12 19.68,21.27 19.68,25.4 20,25.72 29.53,25.72 29.53,28.57 29.85,28.89 43.81,28.89 45.4,30.48 45.4,45.72 46.67,46.99 59.05,46.99 IC3.10
  Bottom 1.016: 24.13,20.95 R20.2 | C1.1 23.94,21.14 24.13,20.95 | 24.13,20.95 R12.2
N$17
  Bottom 0.406: IC1.7 29.75,68.67 27.62,70.8 27.62,74.17 QF1.1
  Bottom 1.27: QF1.1 27.75,75.56 C9.2
N$18  (2 unrouted)
  Bottom 0.406: QF1.3 32.58,70.29 33.34,69.53
  Bottom 0.813: QF1.3 32.58,74.42 31.43,75.56 30.48,75.56 30.16,75.25
N$19  (1 unrouted)
  Bottom 0.61: R42.1 R44.1 0.32,91.76 0.32,86.36 R46.1 | 79.38,90.17 79.38,97.79 S4.4 74.61,97.79 73.03,96.2 73.03,93.98 70.48,93.98 70.48,99.69 0.32,99.69 0.32,94.61
  Bottom 0.813: 0.32,94.61 R42.1 | 79.38,90.17 79.38,89.53 | IC2.1 75.63,86.2 75.56,86.2 79.22,89.69 81.92,89.69 C6.+
N$20
  Bottom 0.61: R18.2 66.19,41.38 IC3.1
  Bottom 0.813: R51.1 64.86,43.43 64.45,43.02 64.14,43.34 IC3.1
N$21  (1 unrouted)
  Bottom 0.61: IC3.7 56.52,41.91 54.46,39.85 R24.2
  Bottom 1.016: R53.1 56.04,41.91 56.36,42.23
N$22
  Bottom 0.406: R24.1 57.3,37.95
  Bottom 0.61: IC3.6 57.78,38.58 R24.1
  Bottom 1.016: R23.A 58.42,36.98 R24.1
N$23
  Bottom 1.422: D1.A SV1.6
N$24  (1 unrouted)
  Bottom 0.61: R26.2 55.09,50.63 56.2,49.53 56.2,48.95 IC3.8
  Bottom 0.813: R52.2 53.81,51.9 55.24,53.34
N$25  (1 unrouted)
  Bottom 0.61: R26.1 57.94,48.79 IC3.9
  Bottom 1.016: R25.A 57.47,56.2 58.26,55.4 58.26,53.5 58.1,53.34 R26.1
N$26  (1 unrouted)
  Bottom 0.61: IC3.14 64.14,50.48 65.41,51.75 65.41,53.34
  Bottom 0.813: R50.2 64.39,48.9 IC3.14
N$27  (1 unrouted)
  Bottom 0.61: R28.1 62.4,50.63 62.86,50.16 IC3.13
  Bottom 1.016: R27.A 62.55,53.34 62.23,53.02 62.23,53.18 62.39,53.34
N$28
  Bottom 1.27: LED9.11 R10.2
N$29
  Bottom 1.422: D2.A 71.44,87.63 SV1.4
N$30
  Bottom 1.27: LED9.7 52.22,94.61 52.22,90.87 R15.2
N$31
  Bottom 1.422: SV1.5 68.58,95.25 X2.2
N$32
  Bottom 0.406: R17.2 LED9.4
N$33  (1 unrouted)
  Bottom 0.406: IC1.18 43.59,68.67 43.5,68.9
  Bottom 0.61: 43.5,68.9 43.5,71.91 51.43,71.91 51.43,70.17
  Bottom 1.422: C7.1 53.21,71.75 L1.1
N$34
  Bottom 0.406: R29.2 LED9.2
N$35
  Bottom 0.406: R30.2 LED9.1
N$36
  Bottom 1.27: LED9.10 R31.2
N$37
  Bottom 0.406: R32.2 39.05,91.12 40.64,89.53 40.16,89.06 40.16,88.11 41.12,87.15 49.53,87.15 49.85,87 49.85,79.69 LED9.5
N$38
  Bottom 0.406: R33.2 38.33,88.35 40.32,86.2 44.45,86.2 LED9.3
N$39
  Bottom 0.406: R35.2 39.6,59.37 41.59,59.37 Q1.B
N$40  (via drill 0.6)
  Top 0.61: v39.69,32.38 v39.69,24.45
  Bottom 0.61: T1.2 35.24,52.7 41.91,46.04 41.91,37.47 39.69,35.24 v39.69,32.38 | v39.69,24.45 39.78,24.36 R38.2
N$41
  Bottom 0.813: R47.2 12.87,86.84 T4.2
N$42
  Bottom 0.406: 4.45,80.64 4.45,81.28 4.29,81.44 4.29,82.87 4.45,83.03 4.45,83.98 4.76,84.3 4.76,88.9 4.45,89.22
  Bottom 0.61: R40.1 4.45,89.22 | 4.45,80.64 4.45,43.02 5.4,42.07 16.57,42.07 Q3.1
N$43  (1 unrouted)
  Bottom 0.406: R41.1 3.17,83.59
  Bottom 0.61: 3.17,83.59 3.17,42.23 | 16.99,33.02 17.14,33.18
  Bottom 0.813: 16.99,33.02 12.38,33.02 3.17,42.23
N$44  (1 unrouted)
  Bottom 0.406: 5.4,81.6 5.4,97.79
  Bottom 0.61: R39.1 5.4,97.79 | 11.59,59.53 11.59,51.59 29.85,51.59 36.35,44.93 36.35,40.32 36.04,40.01 30.16,40.01 30,40.16 30,43.34 | 5.4,81.6 11.59,74.3
  Bottom 0.813: 11.59,59.53 11.59,74.3
N$45
  Bottom 0.61: R41.2 R46.2 T4.3
N$46
  Bottom 0.813: R43.2 12.7,96.84 T2.2
N$47
  Bottom 1.27: Q2.3 32.6,45.5 28.42,50.01 7.14,50.01 6.83,50.32 6.83,75.88 JP1.1
N$48
  Bottom 1.676: Q3.3 6.77,46.41 JP2.1
N$49
  Bottom 1.676: Q4.3 13.44,37.68 JP3.1
N$50
  Bottom 0.813: R45.2 12.22,93.5 11.75,93.03 11.75,90.81 T3.2
N$51
  Bottom 0.406: R48.A 23.81,73.98 24.13,73.66 R49.2
N$52
  Bottom 0.813: R43.1 18.88,94.77 18.73,94.61 SW1.1
N$53
  Bottom 0.813: R45.1 14.77,90.97 SW1.2
N$54
  Bottom 0.813: R47.1 15.71,89.37 SW1.3
N$55
  Bottom 0.813: SW1.6 SW1.5 SW1.4
  Bottom 1.422: S3.4 18.1,81.6 25.72,81.6 25.72,89.53 SW1.4
N$56  (via drill 0.6)  (1 unrouted)
  Top 0.813: v31.75,55.88 v25.72,55.88
  Bottom 0.406: R48.S 20,68.58 | 19.37,62.55 19.21,62.55 | 15.4,62.55 15.24,62.55 | IC1.27 39.05,62.31 39.05,60.96 38.1,60.96 38.1,58.74 37.15,57.15 31.75,57.15 v31.75,55.88
  Bottom 0.813: v25.72,55.88 25.24,55.88 | 20,68.58 20,68.42 19.68,68.1 19.68,63.02 19.21,62.55 15.4,62.55 | 15.24,62.55 14.92,62.55 14.76,62.39 14.76,55.72 25.72,55.72 25.88,55.88
N$57
  Bottom 0.61: D2.C 71.29,82.09 72.07,82.87 72.07,85.09 73.03,86.04 73.98,86.04 75.88,87.95 75.88,89.85 77.79,91.76 77.79,94.93 77.47,95.25 S4.5
  Bottom 1.422: D1.C D2.C
N$58
  Bottom 0.406: IC1.22 49.21,65.47 49.21,65.41
  Bottom 0.61: R50.1 70.17,48.9 70.17,63.5 49.21,63.5 49.21,65.41
N$59
  Bottom 0.406: IC1.19 44.13,67.88 | 44.13,67.88 44.13,67.94 | R51.2 71.6,47.7 71.6,64.45 56.83,64.45 56.83,68.58 49.37,68.58 49.37,70.96 44.45,70.96 44.45,67.88 44.13,67.88
N$60  (2 unrouted)
  Bottom 0.406: 47.31,52.39 R52.1
  Bottom 0.61: 40.64,62.23 40.8,62.06 43.03,62.06 47.31,57.78 47.31,52.39 R52.1
N$61  (via drill 0.6)
  Top 0.813: v51.43,43.81 v51.43,48.58
  Bottom 0.406: IC1.26 39.69,62.29 39.69,60.96 41.59,60.96
  Bottom 0.813: R53.2 51.43,42.06 v51.43,43.81 | v51.43,48.58 49.53,50.48 47.31,50.48 45.72,52.07 45.72,57.78 42.54,60.96 41.59,60.96
N$62
  Bottom 0.406: IC1.20 42.16,66.99 45.61,66.99 C8.1
N$63
  Bottom 1.016: -1.75,101.12 -1.75,-3.49 86.52,-3.49 86.84,-3.17 86.84,101.28 -1.59,101.28 -1.75,101.12
PS_ON  (1 unrouted)
  Bottom 1.27: R5.2 57.94,13.5 57.63,13.81 57.63,29.05 58.42,29.84 58.42,31.11 58.1,31.43 57.78,31.43
  Bottom 1.422: R5.2 65.11,13.5 X3.16
PS_ON_CONTROL
  Bottom 0.406: IC1.30 36.58,60.4 36.51,60.33 35.65,60.33 R35.1
PWN_LOAD  (via drill 0.6)
  Top 0.406: v39.37,77.79 v32.07,77.79
  Bottom 0.406: IC1.13 38.1,71.05 38.1,76.2 39.37,77.47 v39.37,77.79 | v32.07,77.79 32.07,80.64 27.3,80.64 26.35,80.01 20.64,80.01 S3.5
PWR_OK
  Bottom 0.406: X3.8 47.2,4.87 46.04,6.03 45.72,6.03 43.18,8.57 36.51,8.57 36.2,8.89 33.97,8.89 33.97,12.06 37.78,12.06 | 37.78,12.06 37.93,12.06 R4.2 | 37.78,12.06 39.37,13.65
  Bottom 1.016: 39.37,13.65 41.27,13.65 41.59,13.97 R38.1
PWR_OK_CONTROL
  Bottom 0.406: IC1.32 34.98,62.29 33.66,60.96 R37.1 31.66,60.64 30.16,60.64 30.16,54.61
  Bottom 0.61: 30.16,54.61 33.34,54.61 T1.3
VCC5V  (1 unrouted)
  Bottom 0.406: 30.87,67.88 28.89,67.94 | 28.89,67.94 28.89,65.41 32.07,65.41 32.62,66.28 IC1.4 | 28.89,67.94 28.96,67.88 IC1.6 | R36.2 R37.2 R13.1 | R49.1 24.68,67.4 | 28.89,67.94 26.35,70.48 26.35,76.83 33.34,76.83 33.34,84.45 32.38,85.41 32.38,97.16 33.5,97.95 61.75,97.95 63.82,95.89 | 63.82,78.11 62.55,76.83 62.55,65.72 67.31,65.72 67.31,71.75
  Bottom 0.61: IC2.2 78.48,85.03 78.42,84.77 | IC3.4 60.32,45.09 61.28,46.04 83.19,46.04
  Bottom 0.813: 78.42,84.77 78.42,82.55 78.58,82.39 82.16,82.39 83.07,81.48 | 24.68,67.4 24.68,67.08 27.3,64.45 27.78,64.45 | 27.78,64.45 27.94,64.45 28.89,65.41 | 27.78,64.45 27.71,64.38 R36.2 27.39,62.87 C11.1 | 63.82,95.89 63.82,78.26 63.66,78.11
  Bottom 1.27: C5.+ 83.07,81.48
  Bottom 1.422: 83.07,81.48 83.19,81.36 83.19,71.75 | L1.2 67.31,71.75 83.19,71.75 | 83.19,46.04 83.19,71.75
VDC3  (via drill 0.6)
  Top 1.27: v6.99,11.11 v6.99,17.46
  Bottom 1.016: X3.2 73.66,4.87 73.66,0.64 31.12,0.64 | 31.12,4.45 31.51,4.45 X3.12
  Bottom 1.27: 31.12,4.45 31.12,0.64 6.99,0.64 v6.99,11.11 | v6.99,17.46 JP4.1
  Bottom 1.422: R1.2 77.71,13.5 77.71,13.02 | 77.71,13.02 X3.13 | R14.1 78.19,13.5 77.71,13.02
  Bottom 1.676: X3.13 X3.1 X3.2
VDC5  (via drill 0.6)
  Top 1.27: v64.77,-1.27 65.11,-0.93 X3.4
  Bottom 0.61: R11.1 46.04,13.97 45.4,13.34 44.3,13.34 R2.2
  Bottom 1.27: v64.77,-1.27 1.15,-1.27 X4.4@1 1.46,6.67 4.45,6.67 JP5.1
  Bottom 1.422: X3.4 64.77,4.87 64.77,2.54 56.71,2.54 | 56.71,2.54 X3.6 | 56.71,2.54 50.48,2.54 50.48,7.62 46.04,7.62 46.04,10.37 X3.21 X3.22 X3.23 35.71,10.16 44.13,10.16 R2.2
VDC12  (1 unrouted)
  Bottom 0.406: 1.27,98.74 1.27,96.2 4.13,96.2 4.45,95.89 4.45,90.49 1.27,90.49 1.27,87.95 1.59,87.63 3.81,87.63 4.13,87.31 4.13,85.09 0.79,85.09 0.79,82.55 1.91,82.55 | 1.27,98.74 1.27,98.9 | 63.82,98.74 8.41,98.74 8.26,98.9 1.43,98.9 1.27,98.74
  Bottom 0.61: SV1.3 69.85,89.22 66.2,89.22 66.2,97.16 64.45,98.74 63.82,98.74
  Bottom 0.813: 13.34,29.21 1.91,40.64 1.91,82.39
  Bottom 1.016: 11.43,2.54 11.43,13.5 14.29,13.5 23.96,13.5 | 23.96,13.5 R3.2 | 23.96,13.5 24.13,13.34 R12.1
  Bottom 1.27: 14.29,13.5 14.29,29.21 13.34,29.21 1.39,29.21 X4.1@1 JP6.1
  Bottom 1.422: X3.10 X3.11 35.71,6.52 35.24,6.99 26.04,6.99 26.04,2.54 11.43,2.54 11.43,10.48 14.41,10.48 X1.4 X1.3 | 18.73,10.48 18.73,10.37 | X1.3 18.73,10.37 | X1.3 18.61,10.16 18.73,10.16 18.73,10.37
VDC-5
  Bottom 0.61: X3.20 48.31,11.06 46.99,12.38 46.99,17.78 LED7.K
VDC-12  (1 unrouted)
  Bottom 1.422: LED8.K 73.34,10.48 73.66,10.48 73.66,10.16
(copper drawn outside any net)
  shapes: Bottom area x59